# EasyEDA schematic SmokeNEW.json
TITLE: RPi Shield for Fire/Smoke Detection Alarm; REV: 1.0; Date: 2023-10-01; Sheet: 1/1; Drawn By: CHELSEA; Company: CHITKARA UNIVERSITY
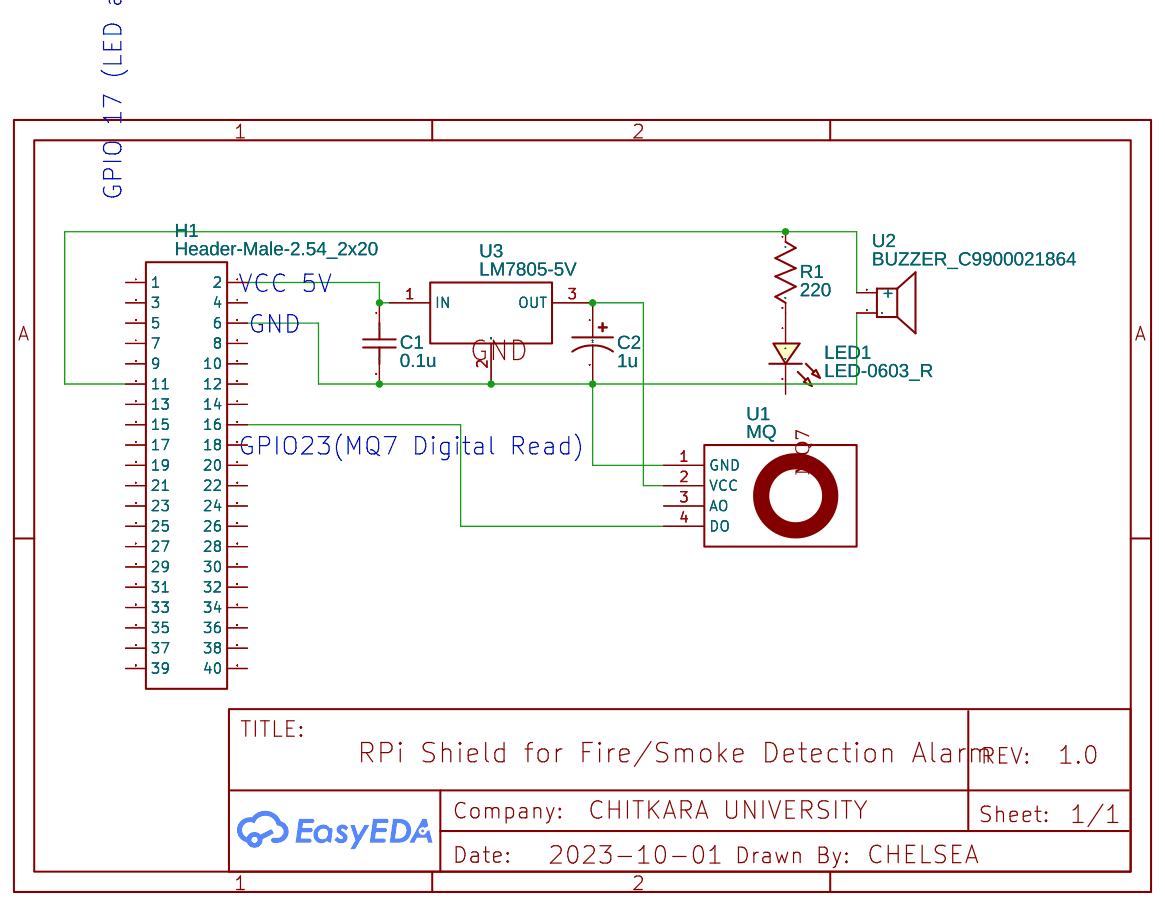
[diagram p0: schematic sheet]

## Parts
C1  0.1u  [C0603]
C2  1u  [CASE-A_3216]
H1  Header-Male-2.54_2x20  [HDR-TH_40P-P2.54-V-M-R2-C20-S2.54]
LED1  LED-0603_R  [LED0603_RED]
R1  220  [R0603]
U1  MQ  [MQ7_SENSOR]
U2  BUZZER_C9900021864  [BUZ-SMD_BUZZER]
U3  LM7805-5V  [TO-252-2_L6.6-W6.1-P4.58-LS9.9-TL]

## Library data of the parts
C1 = C_0603_US: Contributor: LCEDA_Lib
C2 = C_Tan_SMD_A_US: Contributor: LCEDA_Lib
H1 = Header-Male-2.54_2x20: Supplier: LCSC; Manufacturer: BOOMELE(博穆精密); Manufacturer Part: 2.54mm 2*20P直排针; Supplier Part: C50980; JLCPCB Part Class: Extended Part; link: https://lcsc.com/eda_search?q=C50980&%26type=1&ref=editor
LED1 = LED-0603_R: Manufacturer: EVERLIGHT(台湾亿光); Manufacturer Part: 19-217/R6C-AL1M2VY/3T; Supplier Part: C72044; Supplier: LCSC; Contributor: LCEDA_01
R1 = R_0603_US: Contributor: LCEDA_Lib
U1 = MQ: Contributor: oraltrce2002
U2 = BUZZER_C9900021864: Contributor: lcsc; Supplier: LCSC; Supplier Part: C9900021864; Manufacturer: null; Manufacturer Part: BUZZER; JLCPCB Part Class: Extended Part; link: https://lcsc.com/eda_search?q=C9900021864&%26type=1&ref=editor
U3 = LM7805-5V: Contributor: LCSC; Supplier: LCSC; Supplier Part: C9900008050; Manufacturer: null; JLCPCB Part Class: Extended Part; link: https://lcsc.com/eda_search?q=C9900008050&%26type=1&ref=editor

## Nets
Net-(C1-1): C1.1 H1.2 U3.1(IN)
Net-(C1-2): C1.2 C2.2 H1.6 U1.1(GND) U2.1 U3.2(GND)
Net-(C2-1): C2.1 U1.2(VCC) U3.3(OUT)
Net-(H1-11): H1.11 R1.1 U2.2(+)
Net-(H1-16): H1.16 U1.4(DO)
Net-(LED1-1): LED1.1 R1.2

Not connected (* = marked no-connect by the designer): H1 1 3 4 5 7 8 9 10 12 13 14 15 17 18 19 20 21 22 23 24 25 26 27 28 29 30 31 32 33 34 35 36 37 38 39 40; LED1 2; U1 3(AO)

## Notes on the sheet
- GPIO 17 (LED and Buzzer Control)
- VCC 5V
- GND
- GPIO23(MQ7 Digital Read)
